# Altium schematic sheet AMP LM386M-1.SchDoc
size 129 x 74 mm
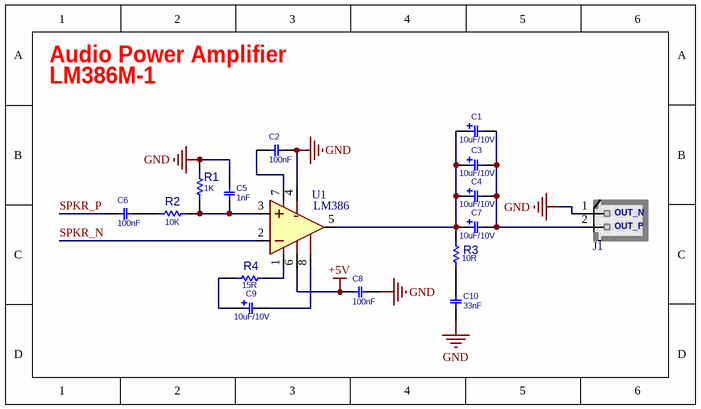
[diagram p0: AMP LM386M-1.SchDoc]

## Parts
C1  10uF/10V  [C_TN_A]
C2  100nF  [C0603]
C3  10uF/10V  [C_TN_A]
C4  10uF/10V  [C_TN_A]
C5  1nF  [C0603]
C6  100nF  [C0603]
C7  10uF/10V  [C_TN_A]
C8  100nF  [C0603]
C9  10uF/10V  [C_TN_A]
C10  33nF  [C0603]
J1  HHDR_2  [XH_2]  (value not drawn)
R1  1K  [R0603]
R2  10K  [R0603]
R3  10R  [R0603]
R4  15R  [R0603]
U1  LM386  [SO_8]

## Nets
+5V: C8.1 U1.6(VS)
GND: C2.1 C5.1 C8.2 C10.1 J1.1 R1.2 U1.4(GND)
SPKR_N: U1.2(IN-)
SPKR_P: C6.2
NetC1_1: C1.1 C3.1 C4.1 C7.1 R3.2 U1.5(VOUT)
NetC1_2: C1.2 C3.2 C4.2 C7.2 J1.2
NetC2_2: C2.2 U1.7(BYPASS)
NetC5_2: C5.2 R1.1 R2.2 U1.3(IN+)
NetC6_1: C6.1 R2.1
NetC9_1: C9.1 R4.2
NetC9_2: C9.2 U1.8(GAIN)
NetC10_2: C10.2 R3.1
NetR4_1: R4.1 U1.1(GAIN)

## Notes on the sheet
- LM386M-1
- Audio Power Amplifier
- (in symbol CONN_PW_SPKR_5264_2A_254MM_1X2) OUT_N; OUT_P

## Library data of the parts
C1 C3 C4 C7 C9 = CAP_SMD_TAN: CAP, SMD, TAN; PARAM: 10V; VALUE: 10uF/10V
C2 C5 C6 C8 C10 = CAP_SMD_MLCC: CAP, SMD, MLCC; PARAM: 50V; DESC: CAP, MLCC, 1nF, 50V, C0G, 10%, 0402; MANF_P#: MANF_PART#; MANF: Murata; PARAM2: C0G, 10%; PRICE: 100= 1$; ASSEMBLY: ASSEMBLY
  C2 C6 C8: VALUE: 100nF
  C5: VALUE: 1nF
  C10: VALUE: 33nF
J1 = CONN_PW_SPKR_5264_2A_254MM_1X2: CONN, 5264-2A, 2.54mm, 2Pos; VALUE: HHDR_2
R1-R4 = RES_SMD: RES, SMD; MANF_P#: RK73H1ETTP4701F; MANF: KOA SPEER; PARAM: 0.063W; DESC: DESCRIPTION; DIST#: MOUSER; PARAM2: 1%; ASSEMBLY: ASSEMBLY; PRICE: 100= 0.5$
  R1: VALUE: 1K
  R2: VALUE: 10K
  R3: VALUE: 10R
  R4: VALUE: 15R
U1 = LM386_SOP8: AMP, Audio, Low Voltage, Power Amp; MANF: Texas Instruments; MANF_P#: LM386MX-1; VALUE: LM386